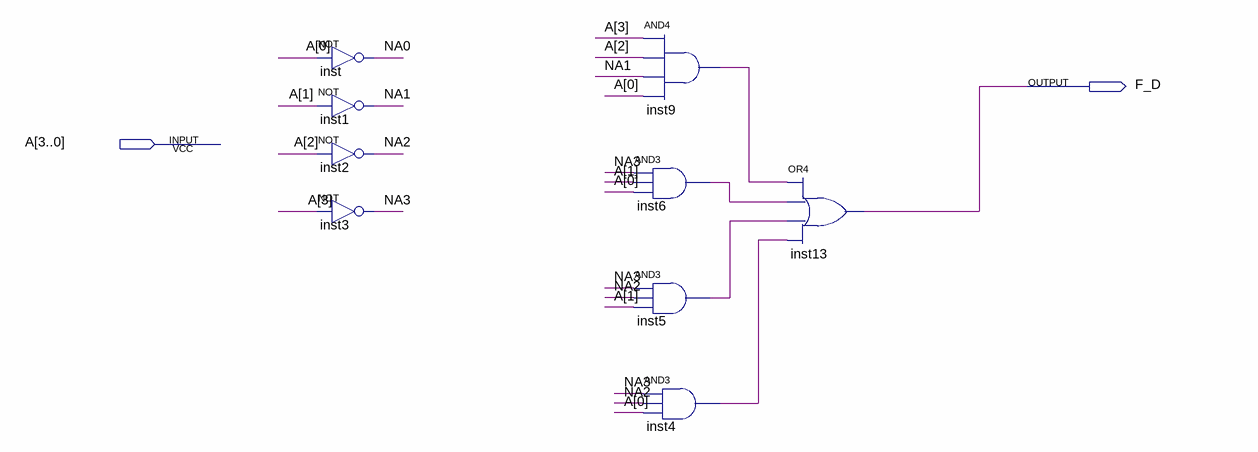
[diagram p0: schematic sheet]
// Quartus schematic Display_F.bdf as structural Verilog: 9 symbols, 2 pins
module Display_F (
  input  [3:0] A,
  output F_D
);

  wire inst4_out, inst5_out, inst6_out, inst9_out, NA0, NA1, NA2, NA3;

  not inst (NA0, A[0]);
  not inst1 (NA1, A[1]);
  not inst2 (NA2, A[2]);
  not inst3 (NA3, A[3]);
  and inst9 (inst9_out, A[3], A[2], NA1, A[0]);
  and inst6 (inst6_out, NA3, A[1], A[0]);
  and inst5 (inst5_out, NA3, NA2, A[1]);
  and inst4 (inst4_out, NA3, NA2, A[0]);
  or inst13 (F_D, inst9_out, inst6_out, inst5_out, inst4_out);
endmodule
